# Altium project UBCSolar_V3_BMS-test-Master.PrjPcb
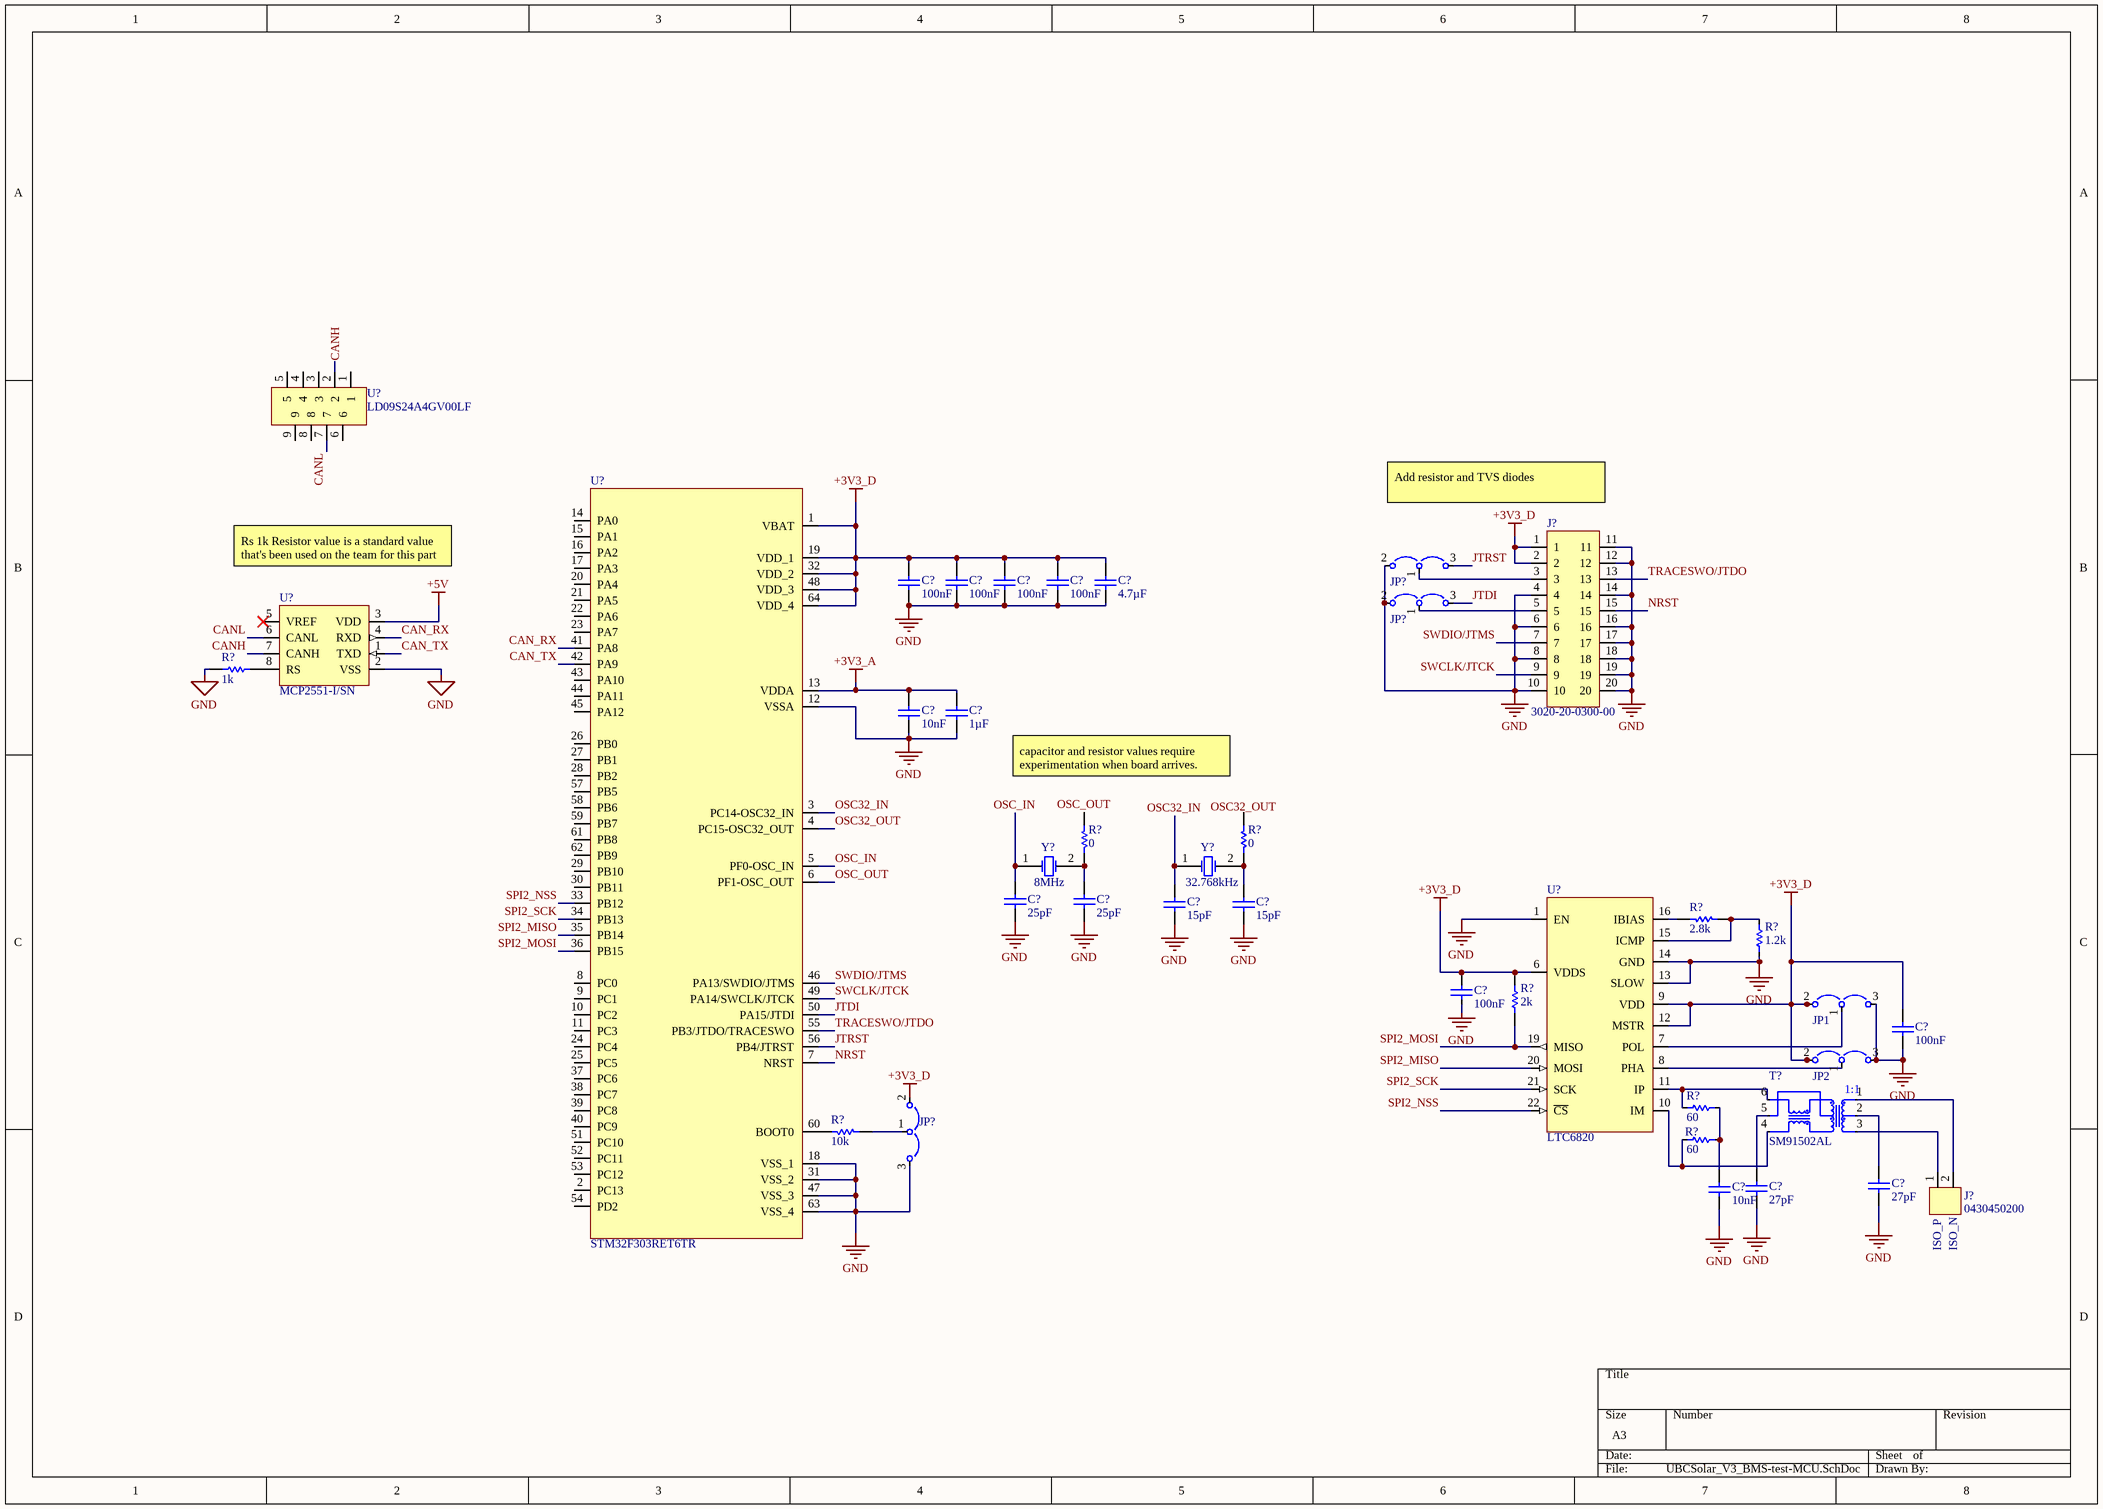
[diagram p0: UBCSolar_V3_BMS-test-MCU.SchDoc]
2 sheets, 39 parts. Net scope: global (net labels, ports and power ports of the same name join across sheets).
Sheets:
  UBCSoalr_V3_BMS-test-power.SchDoc
  UBCSolar_V3_BMS-test-MCU.SchDoc

## Sheet UBCSoalr_V3_BMS-test-power.SchDoc
size A4

## Sheet UBCSolar_V3_BMS-test-MCU.SchDoc
size A3

### Parts
(Parts that share a designator on the sheet are numbered #1, #2 ... from top to bottom, then left to right.)
C?#1  100nF  [RAD-0.3]
C?#2  100nF  [RAD-0.3]
C?#3  100nF  [RAD-0.3]
C?#4  100nF  [RAD-0.3]
C?#5  4.7µF  [RAD-0.3]
C?#6  10nF  [RAD-0.3]
C?#7  1µF  [RAD-0.3]
C?#8  25pF  [RAD-0.3]
C?#9  25pF  [RAD-0.3]
C?#10  15pF  [RAD-0.3]
C?#11  15pF  [RAD-0.3]
C?#12  100nF  [RAD-0.3]
C?#13  100nF  [RAD-0.3]
C?#14  27pF  [RAD-0.3]
C?#15  27pF  [RAD-0.3]
C?#16  10nF  [RAD-0.3]
J?#1  3020-20-0300-00
J?#2  0430450200
JP1  Generic Jumper 3POS  (value not drawn)
JP2  Generic Jumper 3POS  (value not drawn)
JP?#1  Generic Jumper 3POS  (value not drawn)
JP?#2  Generic Jumper 3POS  (value not drawn)
JP?#3  Generic Jumper 3POS  (value not drawn)
R?#1  value 1k  [AXIAL-0.3]
R?#2  value 0  [AXIAL-0.3]
R?#3  value 0  [AXIAL-0.3]
R?#4  value 2.8k  [AXIAL-0.3]
R?#5  value 1.2k  [AXIAL-0.3]
R?#6  value 2k  [AXIAL-0.3]
R?#7  value 60  [AXIAL-0.3]
R?#8  value 10k  [AXIAL-0.3]
R?#9  value 60  [AXIAL-0.3]
T?  SM91502AL
U?#1  LD09S24A4GV00LF
U?#2  MCP2551-I/SN
U?#3  LTC6820
U?#4  STM32F303RET6TR
Y?#1  8MHz  [R38]
Y?#2  32.768kHz  [R38]

### Nets
+3V3_A: C?#6.2 C?#7.2 U?#4.13(VDDA)
+3V3_D: C?#1.2 C?#2.2 C?#3.2 C?#4.2 C?#5.2 C?#12.2 C?#13.2 J?#1.1 J?#1.2 JP1.2 JP2.2 JP?#3.2 R?#6.2 U?#3.6(VDDS) U?#3.9(VDD) U?#3.12(MSTR) U?#4.1(VBAT) U?#4.19(VDD_1) U?#4.32(VDD_2) U?#4.48(VDD_3) U?#4.64(VDD_4)
+5V: U?#2.3(VDD)
GND: C?#1.1 C?#2.1 C?#3.1 C?#4.1 C?#5.1 C?#6.1 C?#7.1 C?#8.1 C?#9.1 C?#10.1 C?#11.1 C?#12.1 C?#13.1 C?#14.2 C?#15.2 C?#16.1 J?#1.4 J?#1.6 J?#1.8 J?#1.10 J?#1.11 J?#1.12 J?#1.14 J?#1.16 J?#1.17 J?#1.18 J?#1.19 J?#1.20 JP1.3 JP2.3 JP?#1.2 JP?#2.2 JP?#3.3 R?#1.2 R?#5.1 U?#2.2(VSS) U?#3.1(EN) U?#3.13(SLOW) U?#3.14(GND) U?#4.12(VSSA) U?#4.18(VSS_1) U?#4.31(VSS_2) U?#4.47(VSS_3) U?#4.63(VSS_4)
CAN_RX: U?#2.4(RXD) U?#4.41(PA8)
CAN_TX: U?#2.1(TXD) U?#4.42(PA9)
CANH: U?#1.2 U?#2.7(CANH)
CANL: U?#1.7 U?#2.6(CANL)
JTDI: JP?#2.3 U?#4.50(PA15/JTDI)
JTRST: JP?#1.3 U?#4.56(PB4/JTRST)
NRST: J?#1.15 U?#4.7(NRST)
OSC32_IN: C?#10.2 U?#4.3(PC14-OSC32_IN) Y?#2.1(OSC1)
OSC32_OUT: U?#4.4(PC15-OSC32_OUT)
OSC_IN: C?#8.2 U?#4.5(PF0-OSC_IN) Y?#1.1(OSC1)
OSC_OUT: R?#2.2 U?#4.6(PF1-OSC_OUT)
SPI2_MISO: U?#3.20(MOSI) U?#4.35(PB14)
SPI2_MOSI: R?#6.1 U?#3.19(MISO) U?#4.36(PB15)
SPI2_NSS: U?#3.22(~{CS}) U?#4.33(PB12)
SPI2_SCK: U?#3.21(SCK) U?#4.34(PB13)
SWCLK/JTCK: J?#1.9 U?#4.49(PA14/SWCLK/JTCK)
SWDIO/JTMS: J?#1.7 U?#4.46(PA13/SWDIO/JTMS)
TRACESWO/JTDO: J?#1.13 U?#4.55(PB3/JTDO/TRACESWO)
NetC?#9_2: C?#9.2 R?#2.1 Y?#1.2(OSC2)
NetC?#11_2: C?#11.2 R?#3.1 Y?#2.2(OSC2)
NetC?#14_1: C?#14.1 T?.5
NetC?#15_1: C?#15.1 T?.2
NetC?#16_2: C?#16.2 R?#7.1 R?#9.1
NetJ?#1_3: J?#1.3 JP?#1.1
NetJ?#1_5: J?#1.5 JP?#2.1
NetJ?#2_1: J?#2.1(ISO_P) T?.3
NetJ?#2_2: J?#2.2(ISO_N) T?.1
NetJP1_1: JP1.1 U?#3.7(POL)
NetJP2_1: JP2.1 U?#3.8(PHA)
NetJP?#3_1: JP?#3.1 R?#8.2
NetR?#1_1: R?#1.1 U?#2.8(RS)
NetR?#4_1: R?#4.1 U?#3.16(IBIAS)
NetR?#4_2: R?#4.2 R?#5.2 U?#3.15(ICMP)
NetR?#7_2: R?#7.2 T?.6 U?#3.11(IP)
NetR?#8_1: R?#8.1 U?#4.60(BOOT0)
NetR?#9_2: R?#9.2 T?.4 U?#3.10(IM)

Not connected (* = marked no-connect by the designer): R?#3 2; U?#1 1 3 4 5 6 8 9; U?#2 5(VREF)*; U?#4 2(PC13) 8(PC0) 9(PC1) 10(PC2) 11(PC3) 14(PA0) 15(PA1) 16(PA2) 17(PA3) 20(PA4) 21(PA5) 22(PA6) 23(PA7) 24(PC4) 25(PC5) 26(PB0) 27(PB1) 28(PB2) 29(PB10) 30(PB11) 37(PC6) 38(PC7) 39(PC8) 40(PC9) 43(PA10) 44(PA11) 45(PA12) 51(PC10) 52(PC11) 53(PC12) 54(PD2) 57(PB5) 58(PB6) 59(PB7) 61(PB8) 62(PB9)

### Notes on the sheet
- Add resistor and TVS diodes
- Rs 1k Resistor value is a standard value that's been used on the team for this part
- (near R?#2) capacitor and resistor values require experimentation when board arrives.
- (near J?#2) ISO_P
- (near J?#2) ISO_N
- Labels drawn without touching a wire or pin: OSC32_OUT
- (in symbol Bourns SM91502AL) 1:1

### Library data of the parts
C?#1-C?#4 C?#12 C?#13 = Cap: Capacitor; Value: 100nF; Supplier 1 Part Number: *; Supplier 1: *
C?#5-C?#11 C?#14-C?#16 = Cap: Capacitor; Value: 100nF; Supplier 1 Part Number: *; Supplier 1: *
J?#1 = CNC Tech 3020-20-0300-00: Supplier 1: Digikey; Supplier 1 Part Number: 1175-1623-ND
J?#2 = Molex Micro-Fit-0430450200: Connector Header Through Hole, Right Angle 2 position; ComponentLink1Description: Digikey; ComponentLink1URL: https://www.digikey.ca/product-detail/en/0430450200/WM1813-ND/252526/?itemSeq=291244174
JP1 JP2 JP?#1-JP?#3 = Generic Jumper 3POS: Connector Header Through Hole 3 position 0.100" (2.54mm); Supplier 1: Digikey; Supplier 1 Part Number: A26545-ND; ComponentLink1Description: Digikey; ComponentLink1URL: https://www.digikey.ca/product-detail/en/te-connectivity-amp/87224-3/A26545-ND/290802?utm_adgroup=&utm_source=google&utm_medium=cpc&utm_campaign=Shopping_Connectors%2C%20Interconnects&utm_term=&productid=290802&gclid=Cj0KCQiAgebwBRDnARIsAE3eZjTuL8WvZd2oySM8EN6lUFsRGiGnwogkufgTSY6DVcbL_nZ1_Snz4GIaAn-oEALw_wcB
R?#1-R?#9 = Res1: Resistor; Supplier 1 Part Number: *; Supplier 1: Digikey
T? = Bourns SM91502AL: 150µH  Pulse Transformer 1CT:1CT Surface Mount
U?#1 = Generic D-SUB 9 Connector: 9 Position D-Sub Receptacle, Female Sockets Connector; ComponentLink1Description: Digikey; ComponentLink1URL: https://www.digikey.ca/product-detail/en/amphenol-icc-fci/LD09S24A4GV00LF/609-5190-ND/4997292; Supplier 1 Part Number: 609-5190-ND; Supplier 1: Digikey
U?#2 = Microchip MCP2551: 1/1 Transceiver Half CANbus 8-SOIC; ComponentLink1Description: Digikey; ComponentLink1URL: https://www.digikey.ca/product-detail/en/microchip-technology/MCP2551-I-SN/MCP2551-I-SN-ND/509452; Supplier 1: Digikey; Supplier Part Number 1: MCP2551-I/SN-ND
U?#3 = LT LTC6820: Isolated Communications Interface Interface 16-MSOP; Supplier 1: Digikey; Supplier Part Number 1: LTC6820IMS#TRPBFCT-ND\
U?#4 = STMicroelectronics STM32F303RET6TR_1 optimized: ARM® Cortex®-M4 STM32F3 Microcontroller IC 32-Bit 72MHz 512KB (512K x 8) FLASH 64-LQFP (10x10) (Optimized pin structuring for schematic wiring); Supplier 1: Digikey; ComponentLink1Description: Digikey; ComponentLink1URL: https://www.digikey.ca/product-detail/en/stmicroelectronics/STM32F303RET6TR/497-18778-1-ND/9958439; Supplier 1 Part Number: 497-18778-1-ND
Y?#1 Y?#2 = XTAL: Crystal Oscillator; ComponentLink1Description: Digikey; Supplier 1: Digikey
  Y?#1: ComponentLink1URL: https://www.digikey.ca/products/en?keywords=535-10630-1-nd; Supplier 1 Part Number: 535-10630-1-ND
  Y?#2: ComponentLink1URL: https://www.digikey.ca/products/en?keywords=535-9544-1-ND; Supplier 1 Part Number: 535-9544-1-ND